# EAGLE design LiPoDisp-uc3b (EAGLE 5.11)
BEST: Farnell 1096979 Bu 1097021
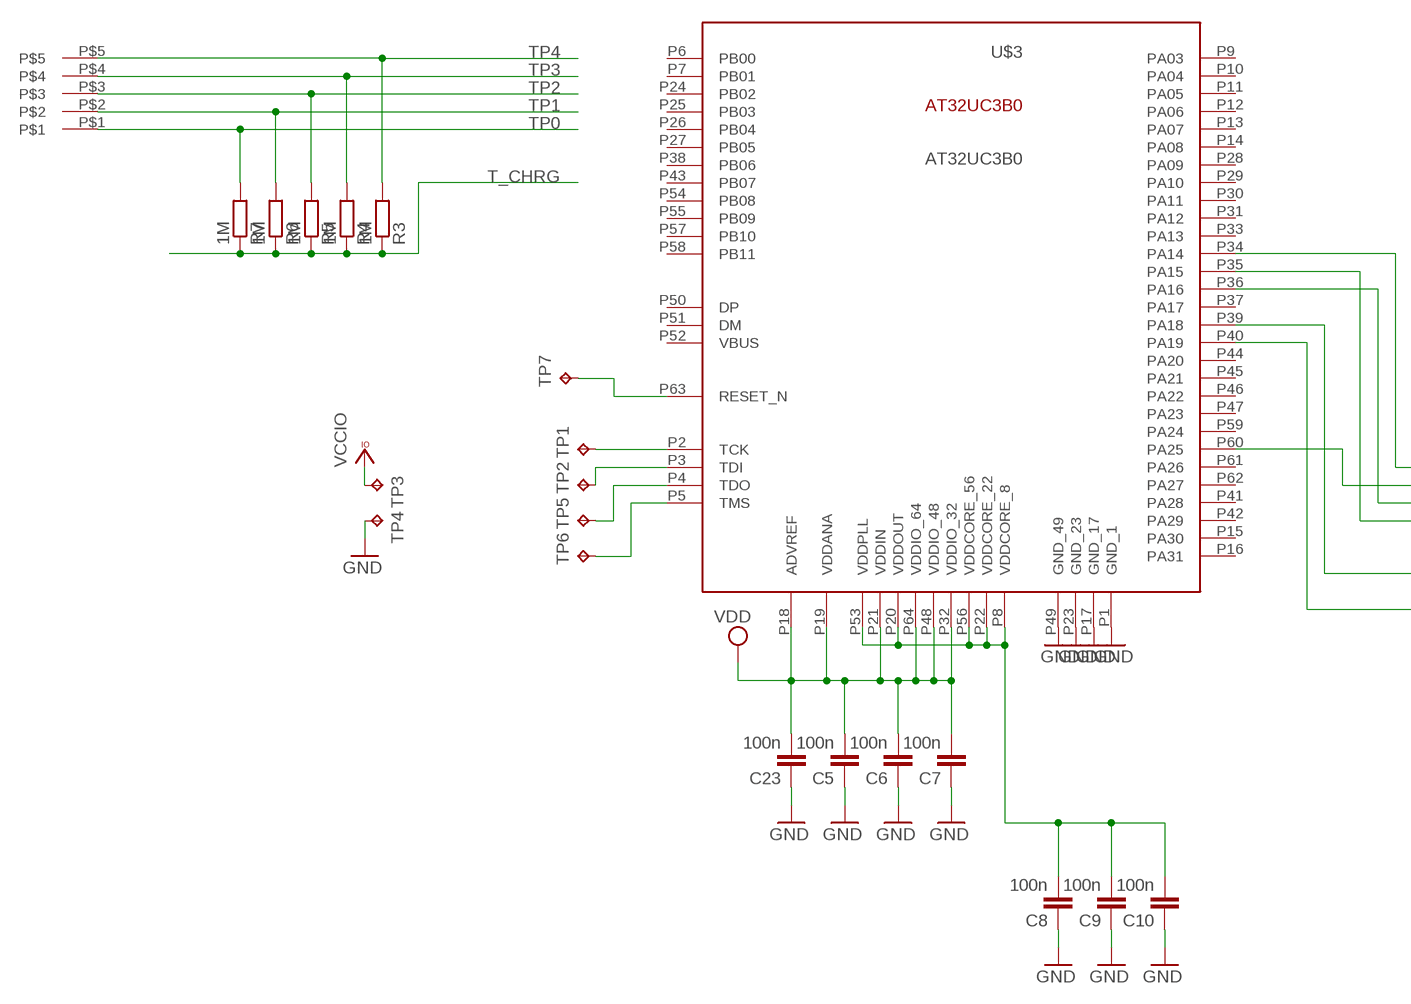
[diagram p0: schematic, sheet 1, part 1 of 2]
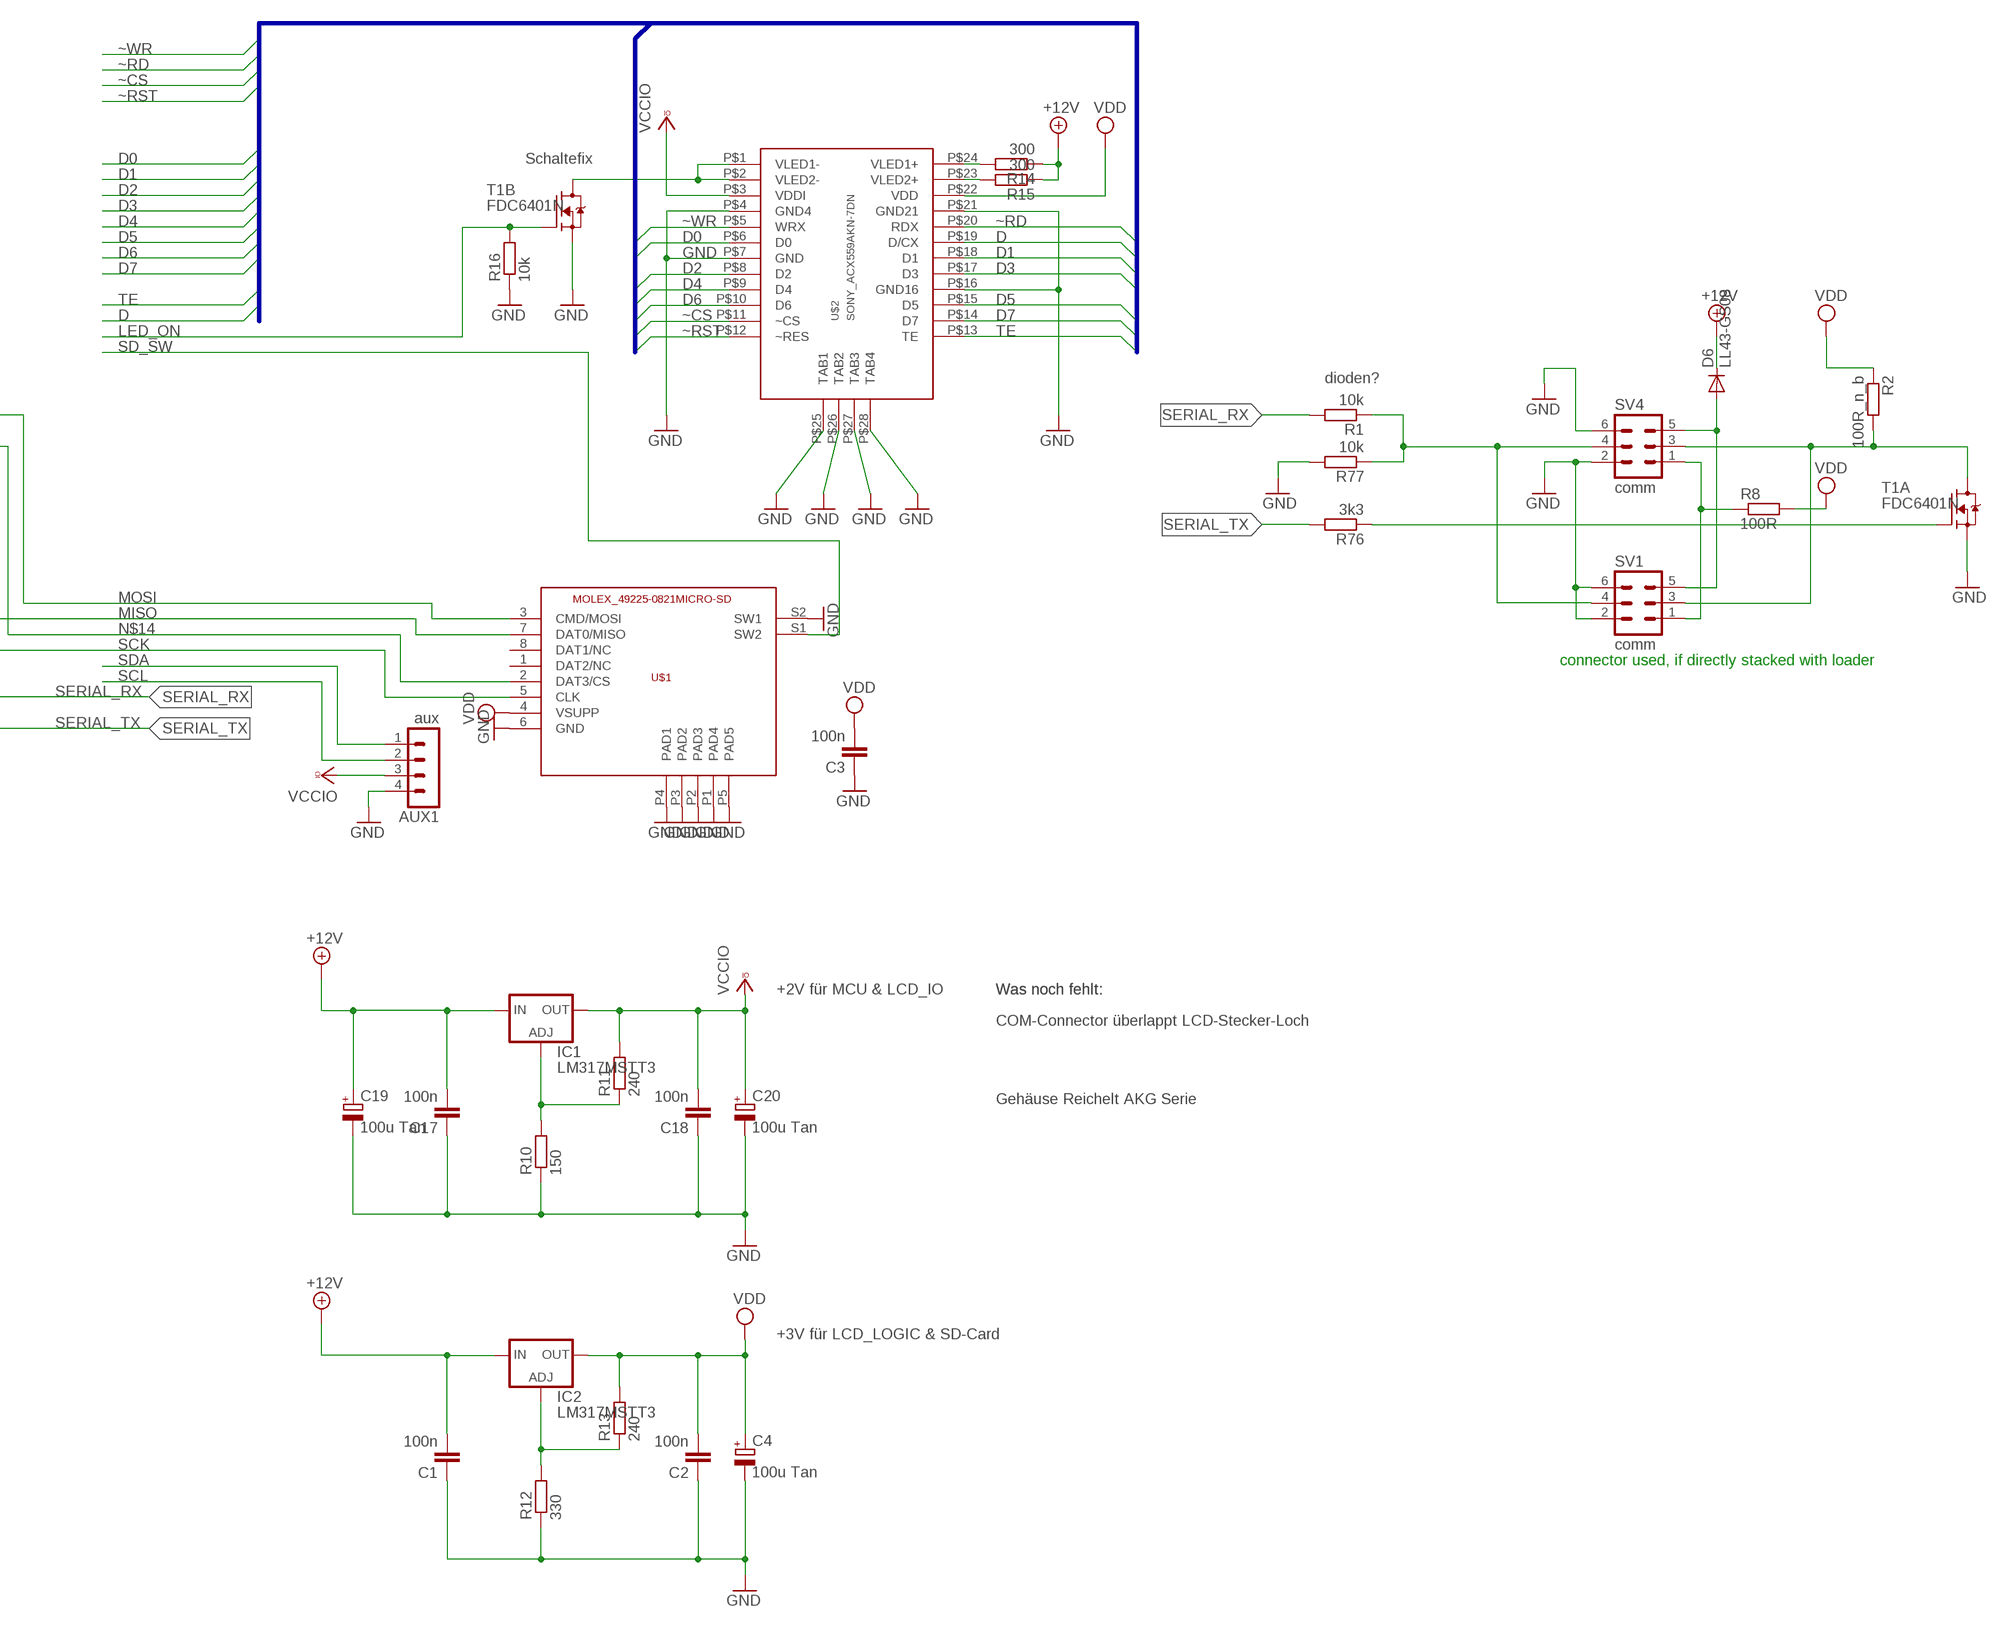
[diagram p1: schematic, sheet 1, part 2 of 2]

## Parts
AUX1  aux  MA04-1  [MA04-1]
C1  100n  C-EUC0603K  [C0603K]
C2  100n  C-EUC0603K  [C0603K]
C3  100n  C-EUC0603K  [C0603K]
C4  100u Tan  CPOL-EUSMCC  [SMC_C]
C5  100n  C-EUC0603K  [C0603K]
C6  100n  C-EUC0603K  [C0603K]
C7  100n  C-EUC0603K  [C0603K]
C8  100n  C-EUC0603K  [C0603K]
C9  100n  C-EUC0603K  [C0603K]
C10  100n  C-EUC0603K  [C0603K]
C17  100n  C-EUC0603K  [C0603K]
C18  100n  C-EUC0603K  [C0603K]
C19  100u Tan  CPOL-EUSMCC  [SMC_C]
C20  100u Tan  CPOL-EUSMCC  [SMC_C]
C23  100n  C-EUC0603K  [C0603K]
D6  LL43-GS08  DIODE-SOD80C  [SOD80C]
IC1  LM317MSTT3  [SOT223]
IC2  LM317MSTT3  [SOT223]
P3  PAD5V  PAD5A  [PAD5V]
R1  10k  R-EU_R0603  [R0603]
R2  100R_n_b  R-EU_R1206  [R1206]
R3  1M  R-EU_R0603  [R0603]
R4  1M  R-EU_R0603  [R0603]
R5  1M  R-EU_R0603  [R0603]
R6  1M  R-EU_R0603  [R0603]
R7  1M  R-EU_R0603  [R0603]
R8  100R  R-EU_R1206  [R1206]
R10  150  R-EU_R0603  [R0603]
R11  240  R-EU_R0603  [R0603]
R12  330  R-EU_R0603  [R0603]
R13  240  R-EU_R0603  [R0603]
R14  300  R-EU_R0603  [R0603]
R15  300  R-EU_R0603  [R0603]
R16  10k  R-EU_R0603  [R0603]
R76  3k3  R-EU_R0603  [R0603]
R77  10k  R-EU_R0603  [R0603]
SV1  comm  ML6L  [ML6L]
SV4  comm  ML6L  [ML6L]
T1  FDC6401N  [SUPERSOT-6]
TP1  TPTP15R  [TP15R]
TP2  TPTP15R  [TP15R]
TP3  TPTP15R  [TP15R]
TP4  TPTP15R  [TP15R]
TP5  TPTP15R  [TP15R]
TP6  TPTP15R  [TP15R]
TP7  TPTP15R  [TP15R]
U$1  MOLEX_49225-0821MICRO-SD  [MOLEX_49225-0821MICRO-SD]
U$2  SONY_ACX559AKN-7DN  [SONY_ACX559AKN-7_A]
U$3  AT32UC3B0  [JEDEC_MS-026]

## Nets
+12V [Lo-Power]: C1.2 C17.2 C19.+ D6.C IC1.3(IN) IC2.3(IN) R14.1 R15.1
D: U$2.P$19(D/CX)
D0: U$2.P$6(D0)
D1: U$2.P$18(D1)
D2: U$2.P$8(D2)
D3: U$2.P$17(D3)
D4: U$2.P$9(D4)
D5: U$2.P$15(D5)
D6: U$2.P$10(D6)
D7: U$2.P$14(D7)
GND [Lo-Power]: AUX1.4 C1.1 C2.1 C3.1 C4.- C5.1 C6.1 C7.1 C8.1 C9.1 C10.1 C17.1 C18.1 C19.- C20.- C23.1 R10.1 R12.1 R16.1 R77.2 SV1.2 SV1.6 SV4.2 SV4.6 T1.P$2(B:S) T1.P$5(A:S) TP4.TP U$1.6(GND) U$1.P1(PAD4) U$1.P2(PAD3) U$1.P3(PAD2) U$1.P4(PAD1) U$1.P5(PAD5) U$1.S2(SW1) U$2.P$4(GND4) U$2.P$7(GND) U$2.P$16(GND16) U$2.P$21(GND21) U$2.P$25(TAB1) U$2.P$26(TAB2) U$2.P$27(TAB3) U$2.P$28(TAB4) U$3.P1(GND_1) U$3.P17(GND_17) U$3.P23(GND_23) U$3.P49(GND_49)
LED_ON: R16.2 T1.P$3(B:G)
MISO: U$1.7(DAT0/MISO) U$3.P60(PA25)
MOSI: U$1.3(CMD/MOSI) U$3.P34(PA14)
N$1: TP1.TP U$3.P2(TCK)
N$2 [Lo-Power]: R8.1 SV1.1 SV4.1
N$3: R2.2 SV1.3 SV4.3 T1.P$6(A:D)
N$4: C8.2 C9.2 C10.2 U$3.P8(VDDCORE_8) U$3.P20(VDDOUT) U$3.P22(VDDCORE_22) U$3.P53(VDDPLL) U$3.P56(VDDCORE_56)
N$5: TP2.TP U$3.P3(TDI)
N$6: TP5.TP U$3.P4(TDO)
N$7: TP6.TP U$3.P5(TMS)
N$8: TP7.TP U$3.P63(RESET_N)
N$10: R76.1 T1.P$1(A:G)
N$14: U$1.2(DAT3/CS) U$3.P36(PA16)
N$15: IC1.1(ADJ) R10.2 R11.1
N$16: IC2.1(ADJ) R12.2 R13.1
N$17: T1.P$4(B:D) U$2.P$1(VLED1-) U$2.P$2(VLED2-)
N$19: R14.2 U$2.P$24(VLED1+)
N$20: R15.2 U$2.P$23(VLED2+)
N$84 [Lo-Power]: D6.A SV1.5 SV4.5
SCK: U$1.5(CLK) U$3.P35(PA15)
SCL: AUX1.2
SD_SW: U$1.S1(SW2)
SDA: AUX1.1
SERIAL_RX: R1.2 U$3.P39(PA18)
SERIAL_RX_R: R1.1 R77.1 SV1.4 SV4.4
SERIAL_TX: R76.2 U$3.P40(PA19)
T_CHRG: R3.1 R4.1 R5.1 R6.1 R7.1
TE: U$2.P$13(TE)
TP0: P3.P$1 R7.2
TP1: P3.P$2 R6.2
TP2: P3.P$3 R5.2
TP3: P3.P$4 R4.2
TP4: P3.P$5 R3.2
VCCIO [Lo-Power]: AUX1.3 C18.2 C20.+ IC1.4(OUT) R11.2 TP3.TP U$2.P$3(VDDI)
VDD [Lo-Power]: C2.2 C3.2 C4.+ C5.2 C6.2 C7.2 C23.2 IC2.4(OUT) R2.1 R8.2 R13.2 U$1.4(VSUPP) U$2.P$22(VDD) U$3.P18(ADVREF) U$3.P19(VDDANA) U$3.P21(VDDIN) U$3.P32(VDDIO_32) U$3.P48(VDDIO_48) U$3.P64(VDDIO_64)
~CS: U$2.P$11(~CS)
~RD: U$2.P$20(RDX)
~RST: U$2.P$12(~RES)
~WR: U$2.P$5(WRX)
Unconnected: U$1.1(DAT2/NC) U$1.8(DAT1/NC) U$3.P6(PB00) U$3.P7(PB01) U$3.P9(PA03) U$3.P10(PA04) U$3.P11(PA05) U$3.P12(PA06) U$3.P13(PA07) U$3.P14(PA08) U$3.P15(PA30) U$3.P16(PA31) U$3.P24(PB02) U$3.P25(PB03) U$3.P26(PB04) U$3.P27(PB05) U$3.P28(PA09) U$3.P29(PA10) U$3.P30(PA11) U$3.P31(PA12) U$3.P33(PA13) U$3.P37(PA17) U$3.P38(PB06) U$3.P41(PA28) U$3.P42(PA29) U$3.P43(PB07) U$3.P44(PA20) U$3.P45(PA21) U$3.P46(PA22) U$3.P47(PA23) U$3.P50(DP) U$3.P51(DM) U$3.P54(PB08) U$3.P55(PB09) U$3.P57(PB10) U$3.P58(PB11) U$3.P59(PA24) U$3.P61(PA26) U$3.P62(PA27)

## Buses
D[0..7],~WR,~RD,~CS,~RST,D,TE

## Notes on the sheet
- Schaltefix
- dioden?
- connector used, if directly stacked with loader
- +2V für MCU & LCD_IO | Was noch fehlt: | Was noch fehlt:
- COM-Connector überlappt LCD-Stecker-Loch
- Gehäuse Reichelt AKG Serie
- +3V für LCD_LOGIC & SD-Card

## Power pins joined to a net without a drawn wire
VBUS: U$3.P52(VBUS)

## Library data of the parts
AUX1 = Fabian:MA04-1: PIN HEADER
C1-C3 C5-C10 C17 C18 C23 = rcl:C-EU: CAPACITOR, European symbol
C4 C19 C20 = rcl:CPOL-EU: POLARIZED CAPACITOR, European symbol
D6 = diode:DIODE-: DIODE
IC1 IC2 = v-reg:LM317?*: 500 mA Adjustable Output Positive Voltage Regulator Source: http://www.onsemi.co.jp .. LM317M-D.PDF
P3 = Fabian:PAD5
R1-R8 R10-R16 R76 R77 = rcl:R-EU_: RESISTOR, European symbol
SV1 SV4 = con-harting-ml:ML6: HARTING
T1 = Fabian:FDC6401N: dual n mosfet; BEST: Farnell 1467966
TP1-TP7 = testpad:TP: Test pad
U$1 = Fabian:MOLEX_49225-0821MICRO-SD: MOLEX_49225-0821MICRO-SD
U$2 = Fabian:SONY_ACX559AKN-7: SONY ACX559AKN-7 full Color display matching connector JST-JAN 24R-JANK-GSAN-TF
U$3 = UC3Bxxxx:AT32UC3B0: The AT32UC3B is a complete System-On-Chip microcontroller based on the AVR32 UC RISC processor running at frequencies up to 60 MHz. AVR32 UC is a high-performance 32-bit RISC microprocessor core, designed for cost-sensitive embedded applications, with particular empha- sis on low power consumption, high code density and high performance.

## Net classes
1 Hi-Power: width 0.3 mm
2 Lo-Power: width 0.3 mm

## Board
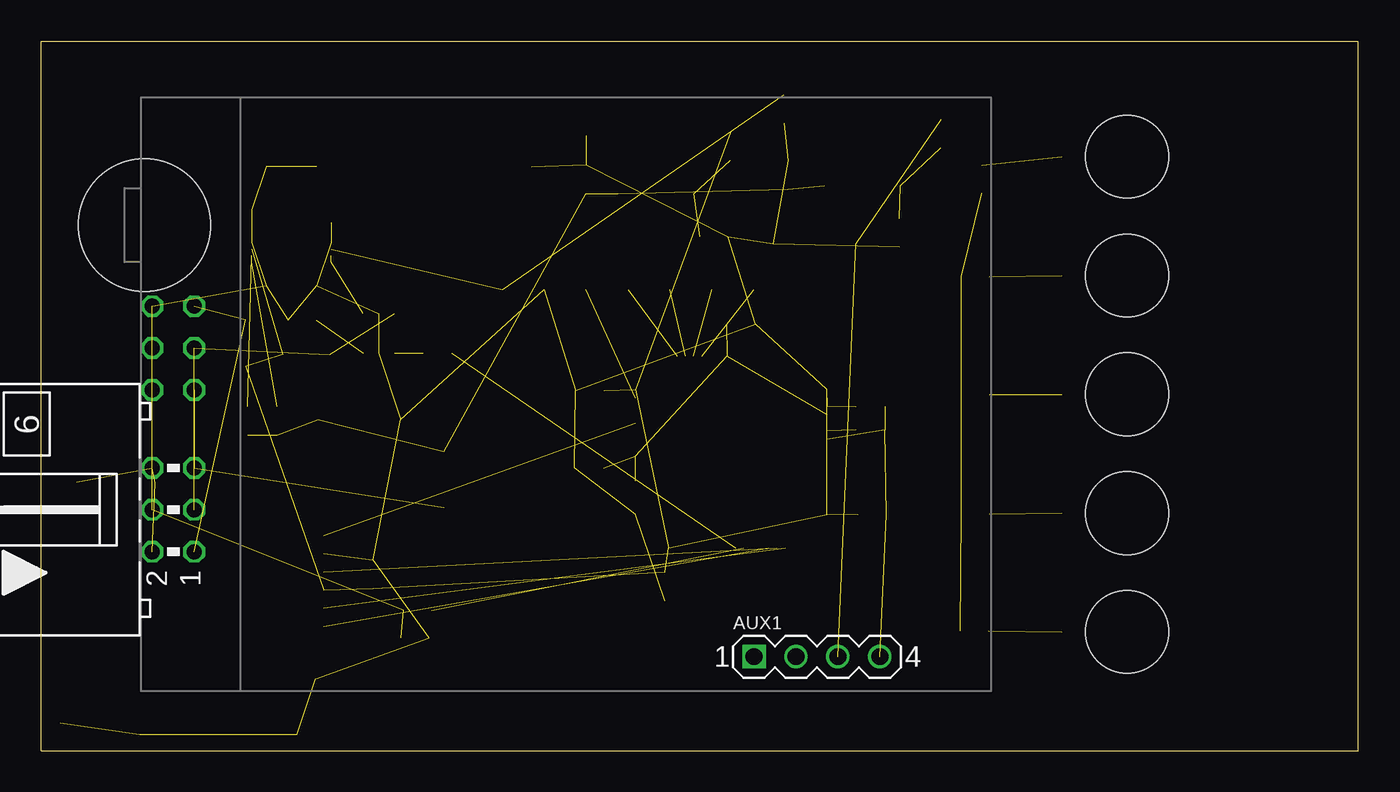
[diagram p2: board, top side]
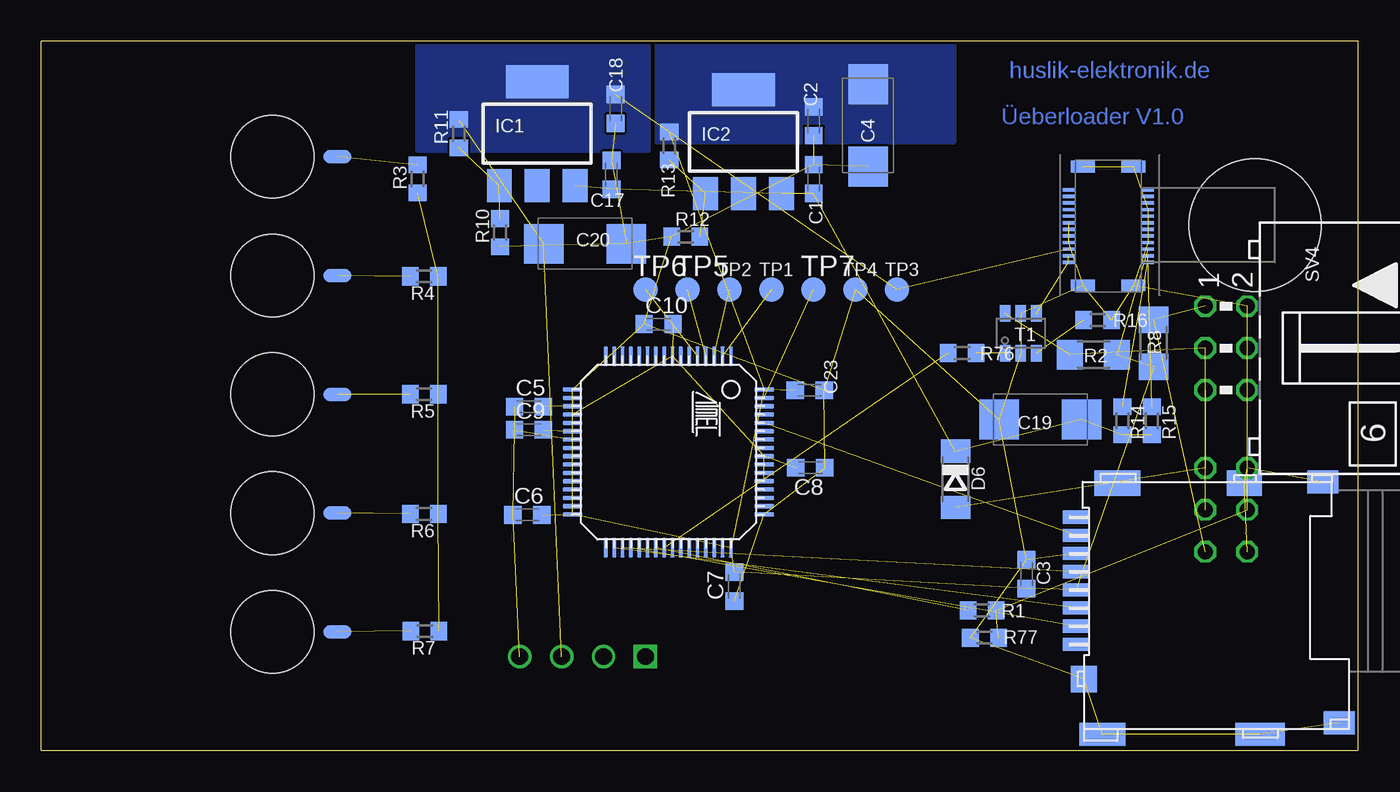
[diagram p3: board, bottom side, seen from below]

Size 79.8 x 43 mm. Coordinates in mm from the lower left corner, seen from the top.
Outline: 0,0 79.8,0 79.8,43 0,43 0,0
Copper layers (1*16): Top 0.035mm / dielectric 1.5mm / Bottom 0.035mm
Design rules "Fischer-LP *": minimum track width 0.15mm, minimum drill 0.3mm, track to track 0.15mm, track to pad 0.15mm, pad to pad 0.15mm, via to via 0.15mm, smd to smd 0mil, copper to edge 0.2mm, drill to drill 0.3mm, minimum pad ring 0.2mm, minimum via ring 0.15mm, stop-mask expansion 0.1mm, vias tented up to drill 0.5mm, thermal gap 0.15mm

### Footprints (pad centres in the part's own frame; a part is rotated, then mirrored left to right if it is on the bottom)
MA04-1 = drill 1.016 square: 1 -3.81,0 | drill 1.016 round: 2 -1.27,0; 3 1.27,0; 4 3.81,0
C0603K = smd 1.05 x 1.08: 1 -0.875,0; 2 0.875,0
SMC_C = smd 2.4 x 2.4: + -2.5,0; - 2.5,0
SOD80C = smd 1.4 x 1.8: A 1.7,0; C -1.7,0
SOT223 = smd 1.5 x 2: 1 -2.3,-3.15; 2 0,-3.15; 3 2.3,-3.15 | smd 3.8 x 2: 4 0,3.15
PAD5V = smd 0.813 x 1.676: P$1 3.6,-3.95; P$2 10.8,-3.95; P$3 18,-3.95; P$4 25.2,-3.95; P$5 32.4,-3.95 | hole 5: 3.6,0; 10.8,0; 18,0; 25.2,0; 32.4,0
R0603 = smd 1 x 1.1: 1 -0.85,0; 2 0.85,0
R1206 = smd 1.6 x 1.803: 1 -1.422,0; 2 1.422,0
ML6L = drill 0.914 octagon: 1 -2.54,-1.27; 2 -2.54,1.27; 3 0,-1.27; 4 0,1.27; 5 2.54,-1.27; 6 2.54,1.27
SUPERSOT-6 = smd 0.65 x 1: P$1 -0.95,-1.2; P$2 0,-1.2; P$3 0.95,-1.2; P$4 0.95,1.2; P$5 0,1.2; P$6 -0.95,1.2
TP15R = smd 1.5 x 1.5: TP 0,0
MOLEX_49225-0821MICRO-SD = smd 0.8 x 1.6: 1 -10.55,16.6; 2 -9.45,16.6; 3 -8.35,16.6; 4 -7.25,16.6; 5 -6.15,16.6; 6 -5.05,16.6; 7 -3.95,16.6; 8 -2.85,16.6 | smd 1.4 x 1.9: P1 -0.7,1.65; P2 -15.3,0.65 | smd 1.4 x 3: P3 -16,5.45 | smd 1.4 x 2.8: P4 -16,15 | smd 1.6 x 1.55: P5 -12.65,16.125 | smd 1.55 x 2.8: S1 -0.775,14.1 | smd 1.55 x 2.1: S2 -0.775,6.4
SONY_ACX559AKN-7_A = smd 0.2 x 0.7: P$1 0,0; P$2 0.4,0; P$3 0.8,0; P$4 1.2,0; P$5 1.6,0; P$6 2,0; P$7 2.4,0; P$8 2.8,0; P$9 3.2,0; P$10 3.6,0; P$11 4,0; P$12 4.4,0; P$13 4.4,-4.8; P$14 4,-4.8; P$15 3.6,-4.8; P$16 3.2,-4.8; P$17 2.8,-4.8; P$18 2.4,-4.8; P$19 2,-4.8; P$20 1.6,-4.8; P$21 1.2,-4.8; P$22 0.8,-4.8; P$23 0.4,-4.8; P$24 0,-4.8 | smd 0.7 x 1.45: P$25 5.8,-0.875; P$26 5.8,-3.925; P$27 -1.4,-3.925; P$28 -1.4,-0.875 | hole 8: 2.25,-11.3
JEDEC_MS-026 = smd 1.2 x 0.27: P1 -6.06,3.535; P2 -6.06,3.03; P3 -6.06,2.525; P4 -6.06,2.02; P5 -6.06,1.515; P6 -6.06,1.01; P7 -6.06,0.505; P8 -6.06,0; P9 -6.06,-0.505; P10 -6.06,-1.01; P11 -6.06,-1.515; P12 -6.06,-2.02; P13 -6.06,-2.525; P14 -6.06,-3.03; P15 -6.06,-3.535; P16 -6.06,-4.04; P33 5.555,-4.04; P34 5.555,-3.535; P35 5.555,-3.03; P36 5.555,-2.525; P37 5.555,-2.02; P38 5.555,-1.515; P39 5.555,-1.01; P40 5.555,-0.505; P41 5.555,0; P42 5.555,0.505; P43 5.555,1.01; P44 5.555,1.515; P45 5.555,2.02; P46 5.555,2.525; P47 5.555,3.03; P48 5.555,3.535 | smd 0.27 x 1.2: P17 -4.04,-6.06; P18 -3.535,-6.06; P19 -3.03,-6.06; P20 -2.525,-6.06; P21 -2.02,-6.06; P22 -1.515,-6.06; P23 -1.01,-6.06; P24 -0.505,-6.06; P25 0,-6.06; P26 0.505,-6.06; P27 1.01,-6.06; P28 1.515,-6.06; P29 2.02,-6.06; P30 2.525,-6.06; P31 3.03,-6.06; P32 3.535,-6.06; P49 3.535,5.555; P50 3.03,5.555; P51 2.525,5.555; P52 2.02,5.555; P53 1.515,5.555; P54 1.01,5.555; P55 0.505,5.555; P56 0,5.555; P57 -0.505,5.555; P58 -1.01,5.555; P59 -1.515,5.555; P60 -2.02,5.555; P61 -2.525,5.555; P62 -3.03,5.555; P63 -3.535,5.555; P64 -4.04,5.555

### Placement (x,y rotation side)
AUX1  47,5.7 0 top
C1  33,34.65 270 bottom
C2  33,38.15 90 bottom
C3  20.1,10.7 270 bottom
C4  29.7,37.9 270 bottom
C5  50.25,20.85 0 bottom
C6  50.35,14.3 0 bottom
C7  37.8,9.95 90 bottom
C8  33.2,17.15 180 bottom
C9  50.25,19.45 0 bottom
C10  42.4,25.85 0 bottom
C17  45.25,34.9 270 bottom
C18  45,38.9 90 bottom
C19  19.27,20.07 180 bottom
C20  46.85,30.73 0 bottom
C23  33.24,21.84 180 bottom
D6  24.4,16.45 270 bottom
IC1  49.75,37.4 0 bottom
IC2  37.25,36.9 0 bottom
P3  65.8,3.6 90 bottom
R1  22.8,8.5 180 bottom
R2  16.05,24 180 bottom
R3  57,34.65 90 bottom
R4  56.6,28.75 180 bottom
R5  56.6,21.6 180 bottom
R6  56.6,14.35 180 bottom
R7  56.55,7.25 180 bottom
R8  12.4,24.7 270 bottom
R10  52,31.4 90 bottom
R11  54.5,37.4 90 bottom
R12  40.75,31.15 0 bottom
R13  41.75,36.65 90 bottom
R14  14.3,20 90 bottom
R15  12.5,20 90 bottom
R16  15.8,26.1 180 bottom
R76  24,24.1 180 bottom
R77  22.65,6.85 180 bottom
SV1  8,14.6 90 top
SV4  8,24.4 270 bottom
T1  20.45,25.3 0 bottom
TP1  35.56,27.94 0 bottom
TP2  38.1,27.94 0 bottom
TP3  27.94,27.94 0 bottom
TP4  30.48,27.94 0 bottom
TP5  40.64,27.94 0 bottom
TP6  43.18,27.94 0 bottom
TP7  33.02,27.94 0 bottom
U$1  0.5,17 90 bottom
U$2  17.55,29.6 90 bottom
U$3  41.55,17.85 270 bottom

### Tracks (layer width: path | path; a pad name or v marks a point on that pad's centre or on a via)
+12V  (7 unrouted)
GND  (45 unrouted)
LED_ON  (1 unrouted)
MISO  (1 unrouted)
MOSI  (1 unrouted)
N$1  (1 unrouted)
N$2  (2 unrouted)
N$3  (3 unrouted)
N$4  (7 unrouted)
N$5  (1 unrouted)
N$6  (1 unrouted)
N$7  (1 unrouted)
N$8  (1 unrouted)
N$10  (1 unrouted)
N$14  (1 unrouted)
N$15  (2 unrouted)
N$16  (2 unrouted)
N$17  (2 unrouted)
N$19  (1 unrouted)
N$20  (1 unrouted)
N$84  (2 unrouted)
SCK  (1 unrouted)
SERIAL_RX  (1 unrouted)
SERIAL_RX_R  (3 unrouted)
SERIAL_TX  (1 unrouted)
T_CHRG  (4 unrouted)
TP0  (1 unrouted)
TP1  (1 unrouted)
TP2  (1 unrouted)
TP3  (1 unrouted)
TP4  (1 unrouted)
VCCIO  (4 unrouted)
  pour Bottom (no thermals): 43,42.9 57,42.9 57,36.4 43,36.4
VDD  (15 unrouted)
  pour Bottom (no thermals): 24.5,42.9 42.5,42.9 42.5,36.9 24.5,36.9

### Text on the board
Bottom: huslik-elektronik.de | Üeberloader V1.0
tDocu: Stecker OK in X und Y